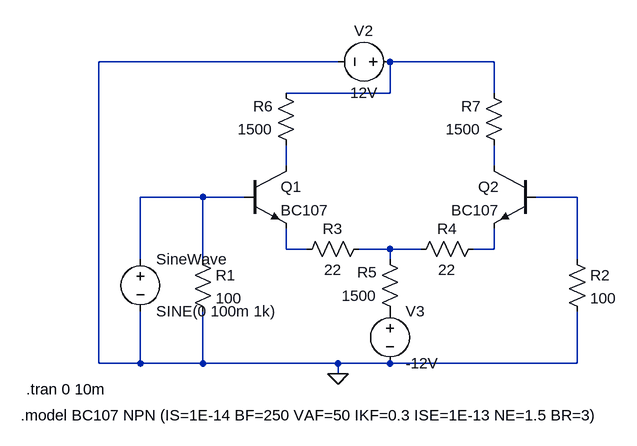
[diagram p0: schematic Differentail amplifier.asc]
Differentail amplifier.asc, the LTspice schematic file:
Version 4.1
SHEET 1 3068 1000
WIRE 224 -32 -144 -32
WIRE 464 -32 304 -32
WIRE 304 16 304 -32
WIRE 304 16 144 16
WIRE 464 16 464 -32
WIRE 144 128 144 96
WIRE 464 128 464 96
WIRE 16 176 -80 176
WIRE 80 176 16 176
WIRE 592 176 528 176
WIRE 144 256 144 224
WIRE 176 256 144 256
WIRE 304 256 256 256
WIRE 352 256 304 256
WIRE 464 256 464 224
WIRE 464 256 432 256
WIRE -80 272 -80 176
WIRE 16 272 16 176
WIRE 304 272 304 256
WIRE 592 272 592 176
WIRE -144 432 -144 -32
WIRE -80 432 -80 352
WIRE -80 432 -144 432
WIRE 16 432 16 352
WIRE 16 432 -80 432
WIRE 224 432 16 432
WIRE 304 432 224 432
WIRE 592 432 592 352
WIRE 592 432 304 432
WIRE 224 448 224 432
FLAG 224 448 0
SYMBOL npn 80 128 R0
SYMATTR InstName Q1
SYMATTR Value BC107
SYMBOL npn 528 128 M0
SYMATTR InstName Q2
SYMATTR Value BC107
SYMBOL res 0 256 R0
SYMATTR InstName R1
SYMATTR Value 100
SYMBOL res 576 256 R0
SYMATTR InstName R2
SYMATTR Value 100
SYMBOL res 272 240 R90
WINDOW 0 0 56 VBottom 2
WINDOW 3 32 56 VTop 2
SYMATTR InstName R3
SYMATTR Value 22
SYMBOL res 448 240 R90
WINDOW 0 0 56 VBottom 2
WINDOW 3 32 56 VTop 2
SYMATTR InstName R4
SYMATTR Value 22
SYMBOL res 320 368 R180
WINDOW 0 36 76 Left 2
WINDOW 3 36 40 Left 2
SYMATTR InstName R5
SYMATTR Value 1500
SYMBOL res 160 112 R180
WINDOW 0 36 76 Left 2
WINDOW 3 36 40 Left 2
SYMATTR InstName R6
SYMATTR Value 1500
SYMBOL res 480 112 R180
WINDOW 0 36 76 Left 2
WINDOW 3 36 40 Left 2
SYMATTR InstName R7
SYMATTR Value 1500
SYMBOL voltage -80 256 R0
WINDOW 123 0 0 Left 0
WINDOW 39 0 0 Left 0
SYMATTR InstName SineWave
SYMATTR Value SINE(0 100m 1k)
SYMBOL voltage 320 -32 R90
WINDOW 0 -32 56 VBottom 2
WINDOW 3 32 56 VTop 2
WINDOW 123 0 0 Left 0
WINDOW 39 0 0 Left 0
SYMATTR InstName V2
SYMATTR Value 12V
SYMBOL voltage 304 336 R0
WINDOW 123 0 0 Left 0
WINDOW 39 0 0 Left 0
SYMATTR InstName V3
SYMATTR Value -12V
TEXT -264 512 Left 2 !.model BC107 NPN (IS=1E-14 BF=250 VAF=50 IKF=0.3 ISE=1E-13 NE=1.5 BR=3)
TEXT -256 472 Left 2 !.tran 0 10m

The netlist it stands for:
* Differentail amplifier.asc
Q1 N002 N004 N006 0 BC107
Q2 N003 N005 N008 0 BC107
R1 N004 0 100
R2 N005 0 100
R3 N007 N006 22
R4 N008 N007 22
R5 P001 N007 1500
R6 N002 N001 1500
R7 N003 N001 1500
V§SineWave N004 0 SINE(0 100m 1k)
V2 N001 0 12V
V3 P001 0 -12V
.model NPN NPN
.model PNP PNP
.lib standard.bjt
.model BC107 NPN (IS=1E-14 BF=250 VAF=50 IKF=0.3 ISE=1E-13 NE=1.5 BR=3)
.tran 0 10m
.backanno
.end